# Altium project Status Board.PrjPcb
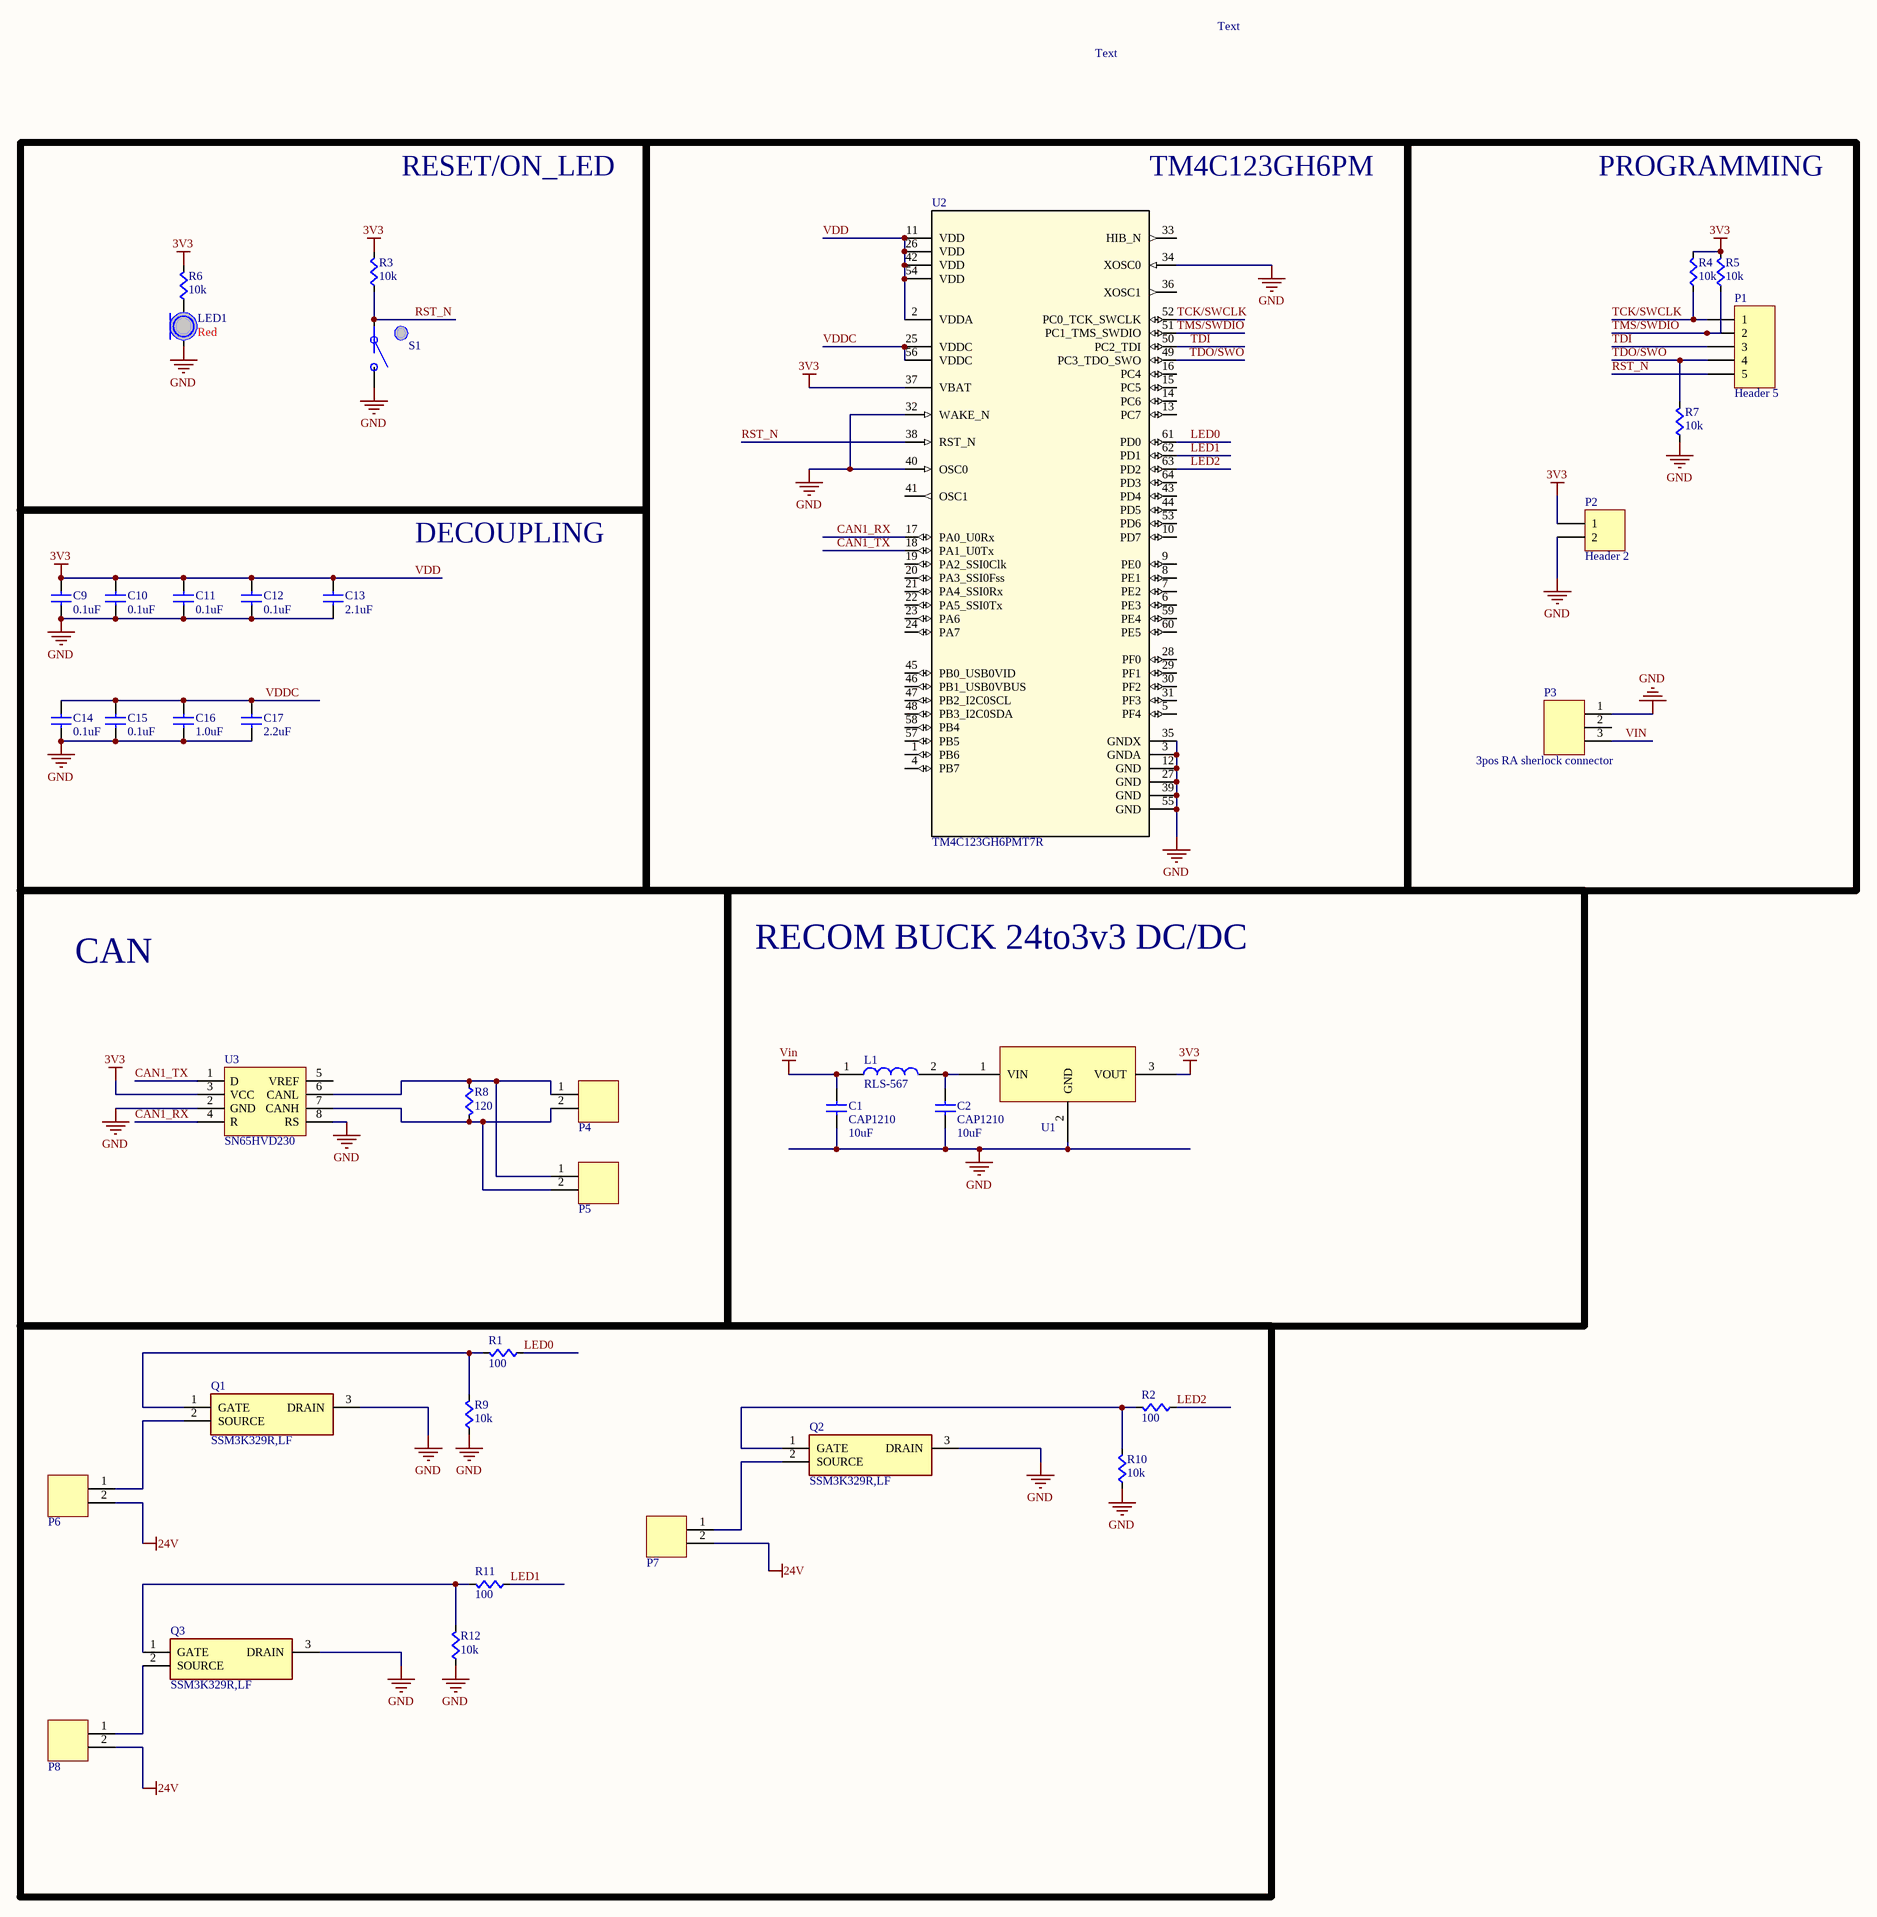
[diagram p0: StatusLED.SchDoc]
1 sheet, 40 parts. Net scope: global (net labels, ports and power ports of the same name join across sheets).
Board file: LedStatus.PcbDoc

## Sheet StatusLED.SchDoc
size C

### Parts
C1  CAP1210  value 10uF  [CAP1210]
C2  CAP1210  value 10uF  [CAP1210]
C9  value 0.1uF  [CAPC0603]  (hidden comment: Cap)
C10  value 0.1uF  [CAPC0603]  (hidden comment: Cap)
C11  value 0.1uF  [CAPC0603]  (hidden comment: Cap)
C12  value 0.1uF  [CAPC0603]  (hidden comment: Cap)
C13  value 2.1uF  [CAPC0603]  (hidden comment: Cap)
C14  value 0.1uF  [CAPC0603]  (hidden comment: Cap)
C15  value 0.1uF  [CAPC0603]  (hidden comment: Cap)
C16  value 1.0uF  [CAPC0603]  (hidden comment: Cap)
C17  value 2.2uF  [CAPC0603]  (hidden comment: Cap)
L1  RLS-567  [RLS567]
LED1  Color: Red  [LED0603]  (hidden comment: LED)
P1  Header 5  [HDR1X5]
P2  Header 2  [HDR1X2]
P3  3pos RA sherlock connector  [MOLEX-HDR-1X3-SHERLOCK-RA]
P4  2-pin Horz Sherlock  [MOLEX-HDR-1X2-SHERLOCK-HORZ]  (value not drawn)
P5  2-pin Horz Sherlock  [MOLEX-HDR-1X2-SHERLOCK-HORZ]  (value not drawn)
P6  2-pin Horz Sherlock  [MOLEX-HDR-1X2-SHERLOCK-HORZ]  (value not drawn)
P7  2-pin Horz Sherlock  [MOLEX-HDR-1X2-SHERLOCK-HORZ]  (value not drawn)
P8  2-pin Horz Sherlock  [MOLEX-HDR-1X2-SHERLOCK-HORZ]  (value not drawn)
Q1  SSM3K329R,LF  [SOTFL95P240X88-3N]
Q2  SSM3K329R,LF  [SOTFL95P240X88-3N]
Q3  SSM3K329R,LF  [SOTFL95P240X88-3N]
R1  value 100  [RES0603]  (hidden comment: Res)
R2  value 100  [RES0603]  (hidden comment: Res)
R3  value 10k  [RES0603]  (hidden comment: Res)
R4  value 10k  [RES0603]  (hidden comment: Res)
R5  value 10k  [RES0603]  (hidden comment: Res)
R6  value 10k  [RES0603]  (hidden comment: Res)
R7  value 10k  [RES0603]  (hidden comment: Res)
R8  value 120  [RES0603]  (hidden comment: Res)
R9  value 10k  [RES0603]  (hidden comment: Res)
R10  value 10k  [RES0603]  (hidden comment: Res)
R11  value 100  [RES0603]  (hidden comment: Res)
R12  value 10k  [RES0603]  (hidden comment: Res)
S1  Button  [PTS645xxxxSMTR92]  (value not drawn)
U1  R-78C3.3-1.0  [R-78C3.3-1.0]  (value not drawn)
U2  TM4C123GH6PMT7R  [PM0064A_N]
U3  SN65HVD230  [SOIC-8pin]

### Blocks framed on the sheet
RESET/ON_LED: LED1 R3 R6 S1
TM4C123GH6PM: U2
PROGRAMMING: P1-P3 R4 R5 R7
DECOUPLING: C9-C17
CAN: P4 P5 R8 U3
RECOM BUCK 24to3v3 DC/DC: C1 C2 L1 U1

### Nets
24V: P6.2 P7.2 P8.2
GND: C1.2(B) C2.2(B) C9.2(B) C10.2(B) C11.2(B) C12.2(B) C13.2(B) C14.2(B) C15.2(B) C16.2(B) C17.2(B) LED1.C P2.2 P3.1 Q1.3(DRAIN) Q2.3(DRAIN) Q3.3(DRAIN) R7.2(B) R9.2(B) R10.2(B) R12.2(B) S1.B U1.2(GND) U2.3(GNDA) U2.12(GND) U2.27(GND) U2.32(WAKE_N) U2.34(XOSC0) U2.35(GNDX) U2.39(GND) U2.40(OSC0) U2.55(GND) U3.2(GND) U3.8(RS)
VDD: C9.1(A) C10.1(A) C11.1(A) C12.1(A) C13.1(A) P2.1 R3.1(A) R4.1(A) R5.1(A) R6.1(A) U1.3(VOUT) U2.2(VDDA) U2.11(VDD) U2.26(VDD) U2.37(VBAT) U2.42(VDD) U2.54(VDD) U3.3(VCC)  [also labelled 3V3]
VIN: C1.1(A) L1.1 P3.3
CAN1_RX: U2.17(PA0_U0Rx) U3.4(R)
CAN1_TX: U2.18(PA1_U0Tx) U3.1(D)
LED0: R1.2(B) U2.61(PD0)
LED1: R11.2(B) U2.62(PD1)
LED2: R2.2(B) U2.63(PD2)
RST_N: P1.5 R3.2(B) S1.A U2.38(RST_N)
TCK/SWCLK: P1.1 R4.2(B) U2.52(PC0_TCK_SWCLK)
TDI: P1.3 U2.50(PC2_TDI)
TDO/SWO: P1.4 R7.1(A) U2.49(PC3_TDO_SWO)
TMS/SWDIO: P1.2 R5.2(B) U2.51(PC1_TMS_SWDIO)
VDDC: C14.1(A) C15.1(A) C16.1(A) C17.1(A) U2.25(VDDC) U2.56(VDDC)
NetC2_1: C2.1(A) L1.2 U1.1(VIN)
NetLED1_A: LED1.A R6.2(B)
NetP4_1: P4.1 P5.1 R8.2(B) U3.6(CANL)
NetP4_2: P4.2 P5.2 R8.1(A) U3.7(CANH)
NetP6_1: P6.1 Q1.2(SOURCE)
NetP7_1: P7.1 Q2.2(SOURCE)
NetP8_1: P8.1 Q3.2(SOURCE)
NetQ1_1: Q1.1(GATE) R1.1(A) R9.1(A)
NetQ2_1: Q2.1(GATE) R2.1(A) R10.1(A)
NetQ3_1: Q3.1(GATE) R11.1(A) R12.1(A)

Not connected (* = marked no-connect by the designer): P3 2; U2 1(PB6) 4(PB7) 5(PF4) 6(PE3) 7(PE2) 8(PE1) 9(PE0) 10(PD7) 13(PC7) 14(PC6) 15(PC5) 16(PC4) 19(PA2_SSI0Clk) 20(PA3_SSI0Fss) 21(PA4_SSI0Rx) 22(PA5_SSI0Tx) 23(PA6) 24(PA7) 28(PF0) 29(PF1) 30(PF2) 31(PF3) 33(HIB_N) 36(XOSC1) 41(OSC1) 43(PD4) 44(PD5) 45(PB0_USB0VID) 46(PB1_USB0VBUS) 47(PB2_I2C0SCL) 48(PB3_I2C0SDA) 53(PD6) 57(PB5) 58(PB4) 59(PE4) 60(PE5) 64(PD3); U3 5(VREF)

### Notes on the sheet
- Text

### Library data of the parts
C1 C2 = CAP1210: CAP CER 10UF 50V 20% X5R 1210; Supplier 1: Digi-Key; Supplier Part Number 1: 587-2225-1-ND
L1 = RLS-567: Inductor; Manufacturer_Name: RECOM Power; Datasheet Link: https://componentsearchengine.com/Datasheets/1/RLS-567.pdf; Height: 3.1mm; Mouser Part Number: 919-RLS-567; Mouser Price/Stock: https://www.mouser.com/Search/Refine.aspx?Keyword=919-RLS-567; Manufacturer_Part_Number: RLS-567
P1 = Header 5: Header, 5-Pin; LatestRevisionDate: 17-Jul-2002; LatestRevisionNote: Re-released for DXP Platform.; Publisher: Altium Limited
P2 = Header 2: Header, 2-Pin; LatestRevisionDate: 17-Jul-2002; LatestRevisionNote: Re-released for DXP Platform.; Publisher: Altium Limited
P3 = MOLEX-HDR-1x3-SHERLOCK_RA: Header, Molex, 2mm Pitch Sherlock Header, Single Row, Right Angle 3 Circuits, Length 3.3mm; Manufacturer Part Number: 35363-0360; Manufacturer: Molex Connector Corporation; Supplier Part Number 1: WM18932-ND; Supplier 1: Digi-Key
P4-P8 = MOLEX-HDR-1x2-SHERLOCK_RA: Header, Molex, 2mm Pitch Sherlock Header, Single Row, Horizontal, 2 Circuits, Length 3.3mm,  0353630260; Manufacturer: Molex Inc; Manufacturer Part Number: 0353630260; Supplier Part Number 1: WM18931-ND; Supplier 1: Digi-Key
Q1-Q3 = SSM3K329R,LF: Transistor; Manufacturer_Name: Toshiba; Datasheet Link: https://toshiba.semicon-storage.com/info/docget.jsp?did=2157&prodName=SSM3K329R; Height: 0.88mm; Manufacturer_Part_Number: SSM3K329R,LF
S1 = Button: SPST Button; Supplier 1: Digi-Key; Supplier Part Number 1: CKN9087CT-ND
U1 = R-78C3.3-1.0: CONV DC/DC 1A 3.3V OUT SIP VERT; Supplier 1: Digi-Key; Supplier Part Number 1: 945-1394-5-ND
U2 = TM4C123GH6PMT7R: Imported; PartNumber: TM4C123GH6PMTR; Manufacturer: Texas Instruments; CompType: IC; PIN_COUNT: 64; Application_BuildNumber: *; Alternate_PartNumber: TM4C123GH6PMT; PackageReference: PM0064A; MountType: SMT; RoHS: Y; RefDes: RefDes; TYPE: TYPE; Value: Value
U3 = SN65HVD230: 3.3V CAN Bus Transceiver
C9-C17 = Cap: Supplier 1: Digi-Key; Supplier Part Number 1: 1276-1000-1-ND
LED1 = LED: Supplier 1: Digi-Key; Supplier Part Number 1: 754-1122-1-ND
R1-R12 = Res: Supplier 1: Digi-Key; Supplier Part Number 1: RMCF0603JT10K0CT-ND